# EAGLE design camera-tiny84-mark3 (EAGLE 7.4.0)
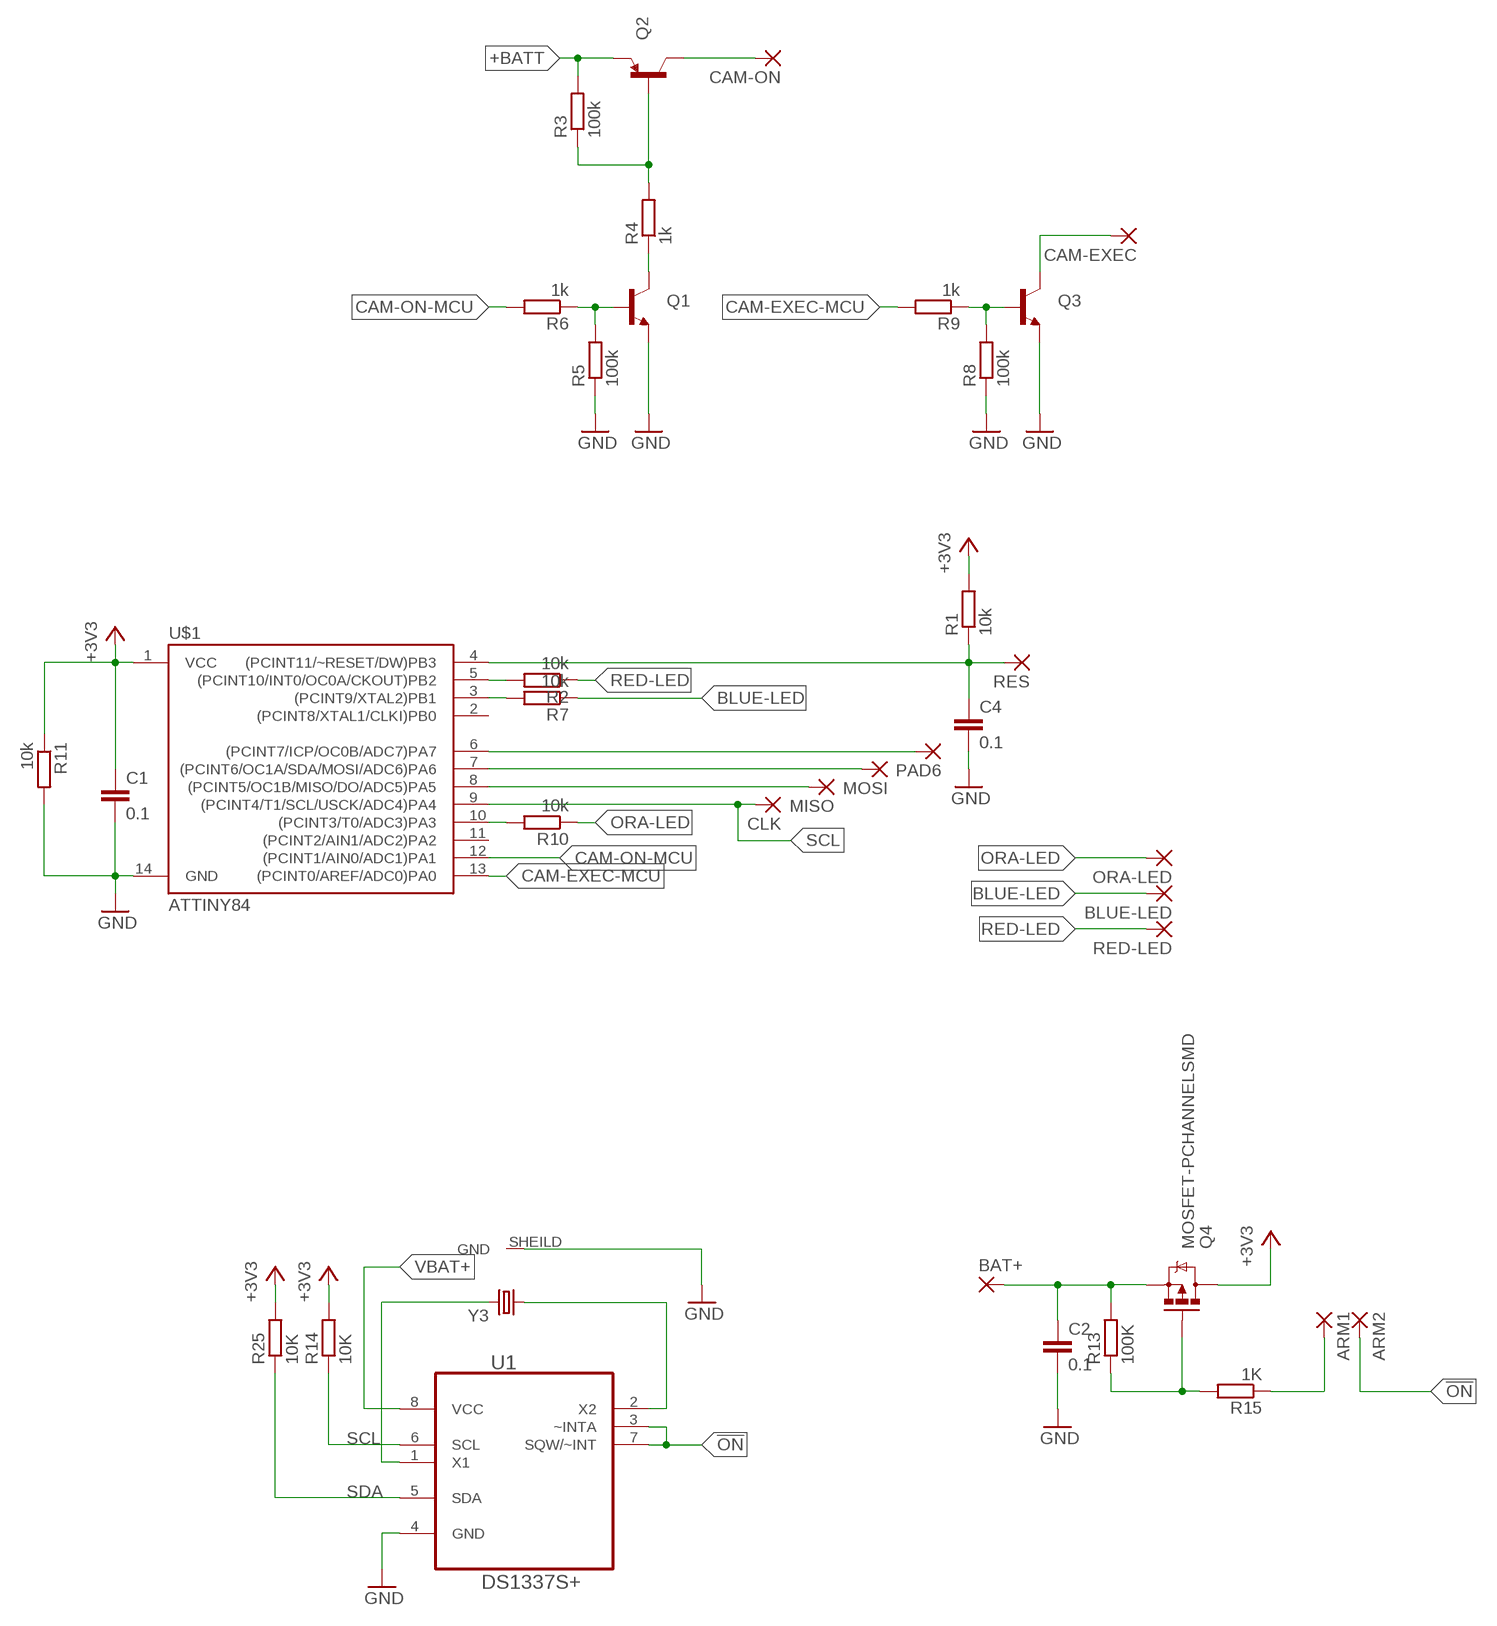
[diagram p0: schematic, sheet 1]

## Parts
ARM1  SMD2  [SMD1,27-2,54]
ARM2  SMD2  [SMD1,27-2,54]
BAT+  SMD2  [SMD1,27-2,54]
BLUE-LED  SMD2  [SMD1,27-2,54]
C1  0.1  C-EUC0603  [C0603]
C2  0.1  C-EUC0603  [C0603]
C4  0.1  C-EUC1206  [C1206]
CAM-EXEC  SMD2  [SMD1,27-2,54]
CAM-ON  SMD2  [SMD1,27-2,54]
CLK  1,6/0,8  [1,6/0,8]
MISO  1,6/0,8  [1,6/0,8]
MOSI  1,6/0,8  [1,6/0,8]
ORA-LED  SMD2  [SMD1,27-2,54]
PAD6  SMD2  [SMD1,27-2,54]
Q1  TRANSISTOR_NPNSOT23-3  [SOT23-3]
Q2  TRANSISTOR_PNPSMD  [SOT23-3]
Q3  TRANSISTOR_NPNSOT23-3  [SOT23-3]
Q4  MOSFET-PCHANNELSMD  [SOT23-3]
R1  10k  R-EU_R0603  [R0603]
R2  10k  R-EU_R0603  [R0603]
R3  100k  R-EU_R0603  [R0603]
R4  1k  R-EU_R0603  [R0603]
R5  100k  R-EU_R0603  [R0603]
R6  1k  R-EU_R0603  [R0603]
R7  10k  R-EU_R0603  [R0603]
R8  100k  R-EU_R0603  [R0603]
R9  1k  R-EU_R0603  [R0603]
R10  10k  R-EU_R0603  [R0603]
R11  10k  R-EU_R0603  [R0603]
R13  100K  R-EU_R0603  [R0603]
R14  10K  R-EU_R0603  [R0603]
R15  1K  R-EU_R0603  [R0603]
R25  10K  R-EU_R0603  [R0603]
RED-LED  SMD2  [SMD1,27-2,54]
RES  1,6/0,8  [1,6/0,8]
U1  DS1337S+  [SOIC127P600X175-8N]
U$1  ATTINY84  [SO14]
Y3  CRYSTAL32-SMD_CRYSTAL32-SMD  [CRYSTAL32-SMD_CRYSTAL-32KHZ-SMD]

## Nets
!ON: ARM2.1(P) U1.3(~INTA) U1.7(SQW/~INT)
+3V3: C1.1 Q4.3(D) R1.2 R11.1 R14.2 R25.2 U$1.1(VCC)
+BATT: Q2.2(E) R3.2
BLUE-LED: BLUE-LED.1(P) R7.1
CAM-EXEC-MCU: R9.2 U$1.13((PCINT0/AREF/ADC0)PA0)
CAM-ON-MCU: R6.2 U$1.12((PCINT1/AIN0/ADC1)PA1)
GND: C1.2 C2.2 C4.2 Q1.2(E) Q3.2(E) R5.1 R8.1 R11.2 U1.4(GND) U$1.14(GND) Y3.SHEILD(GND)
N$1: MISO.1(P) U$1.8((PCINT5/OC1B/MISO/DO/ADC5)PA5)
N$2: PAD6.1(P) U$1.6((PCINT7/ICP/OC0B/ADC7)PA7)
N$3: C4.1 R1.1 RES.1(P) U$1.4((PCINT11/~RESET/DW)PB3)
N$4: CAM-EXEC.1(P) Q3.3(C)
N$5: Q2.1(B) R3.1 R4.2
N$6: Q1.3(C) R4.1
N$7: Q1.1(B) R5.2 R6.1
N$8: Q3.1(B) R8.2 R9.1
N$9: CAM-ON.1(P) Q2.3(C)
N$10: Q4.1(G) R13.1 R15.2
N$11: ARM1.1(P) R15.1
N$12: R2.2 U$1.5((PCINT10/INT0/OC0A/CKOUT)PB2)
N$13: R7.2 U$1.3((PCINT9/XTAL2)PB1)
N$14: R10.2 U$1.10((PCINT3/T0/ADC3)PA3)
N$17: U1.2(X2) Y3.X1
N$18: U1.1(X1) Y3.X2
ORA-LED: ORA-LED.1(P) R10.1
RED-LED: R2.1 RED-LED.1(P)
SCL: CLK.1(P) R14.1 U1.6(SCL) U$1.9((PCINT4/T1/SCL/USCK/ADC4)PA4)
SDA: MOSI.1(P) R25.1 U1.5(SDA) U$1.7((PCINT6/OC1A/SDA/MOSI/ADC6)PA6)
VBAT+: BAT+.1(P) C2.1 Q4.2(S) R13.2 U1.8(VCC)
Unconnected: U$1.2((PCINT8/XTAL1/CLKI)PB0) U$1.11((PCINT2/AIN1/ADC2)PA2)

## Library data of the parts
ARM1 ARM2 BAT+ BLUE-LED CAM-EXEC CAM-ON ORA-LED PAD6 RED-LED = wirepad:SMD2: SMD PAD
C1 C2 C4 = rcl:C-EU: CAPACITOR, European symbol
CLK MISO MOSI RES = wirepad:1,6/0,8: THROUGH-HOLE PAD
Q1 Q3 = SparkFun-DiscreteSemi:TRANSISTOR_NPN: Generic NPN BJT MMBT2222A - TRANS-08049 (SOT-23, 1A 40V) MPSA42 - TRANS-09116 (SOT-23, 500mA 300V) MMBT5088LT1G - TRANS-11160 (SOT-23, 50 mA 30V) BC547 - COM-08928 <http://www.sparkfun.com/products/8928> (TO-92 45V 100mA) (1.Collector 2.Base 3.Emitter) 2N3904 - COM-00521 <http://www.sparkfun.com/products/521> (TO-92 40V 200mA) (1.Emitter 2.Base 3.Collector) P2N2222A - COM-12852 <http://www.sparkfun.com/products/12852> (TO-92 40V 600mA) (1.Collector 2.Base 3.Emitter); PROD_ID: TRANS-08049
Q2 = SparkFun-DiscreteSemi:TRANSISTOR_PNP: Generic PNP BJT Double check pinouts against datasheets- not all devices are the same! MMBT3906 - 40V 200mA SOT-23 (TRANS-08052) MMBT4403 - 40V 600mA SOT-23 (TRANS-09245)
Q4 = SparkFun-DiscreteSemi:MOSFET-PCHANNEL: Generic PMOSFET IRLML2244 - TRANS-11153 (SOT-23 -20V -4.3A) (1.Gate 2.Source 3.Drain) FQP27P06 - COM-10349 <http://www.sparkfun.com/products/10349> (TO-220 -60V -27A) (1.Gate 2.Source 3.Drain)
R1-R11 = rcl:R-EU_: RESISTOR, European symbol
R13-R15 R25 = resistor:R-EU_: RESISTOR, European symbol
U1 = Maxim_By_element14_Batch_1:DS1337S+: 64 x 8, Serial, I2C Real-Time Clock; MPN: DS1337S+; OC_FARNELL: 1379748; OC_NEWARK: 08J6237; PACKAGE: SOIC-8; SUPPLIER: Maxim
U$1 = SparkFun-DigitalIC:ATTINY84: Atmel 14-pin 2/4/8kB flash uC; PROD_ID: IC-11285
Y3 = purva_baterija:CRYSTAL32-SMD_CRYSTAL: Various standard crystals. Proven footprints.; PROD_ID: XTAL-07894

## Net classes
0 default: clearance 0.205 mm

## Board
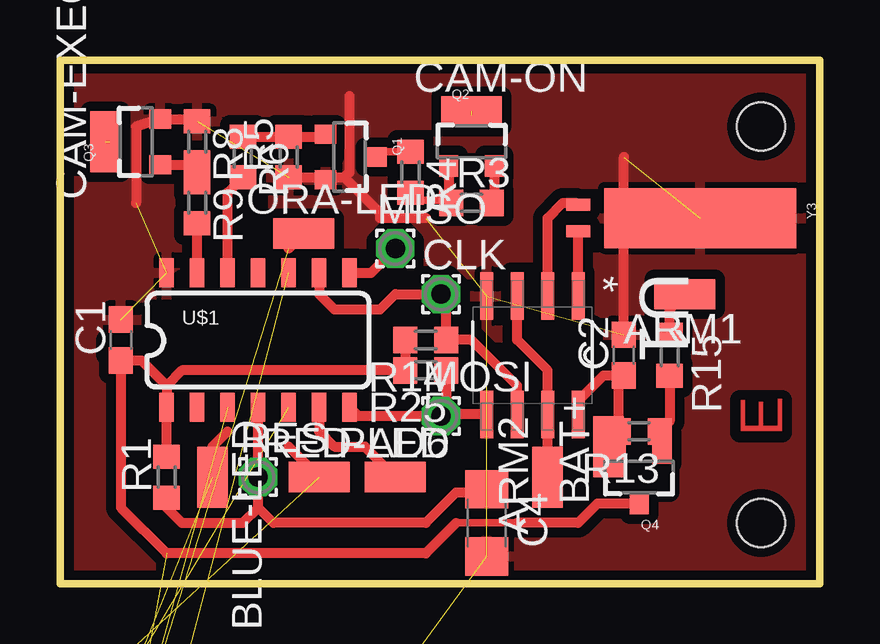
[diagram p1: board, top side]

Size 31.65 x 21.82 mm. Coordinates in mm from the lower left corner, seen from the top.
Outline: 31.65,0 31.65,21.82 0,21.82 0,0 31.65,0
Copper layers (1*16): Top 0.035mm / dielectric 1.5mm / Bottom 0.035mm
Design rules "default *": minimum track width 10mil, minimum drill 24mil, track to track 8mil, track to pad 8mil, pad to pad 8mil, via to via 8mil, smd to smd 8mil, copper to edge 10mil, drill to drill 8mil, minimum pad ring 10mil, minimum via ring 8mil, stop-mask expansion 4mil, vias tented up to drill 0mil, thermal gap 10mil
Holes 2 mm at 29.21,19.05 29.21,2.54
tRestrict: area 4.4,18.4 to 5.1,19.1; area 10.2,17.8 to 10.8,18.4; area 10.8,17.8 to 11.4,18.4; area 3.8,18.4 to 4.4,19.1; area 5.1,12.1 to 10.2,12.7; area 1.9,9.5 to 3.2,10.2; area 24.1,3.8 to 25.4,4.4; area 20.3,8.9 to 21.6,10.8; area 21.6,8.9 to 23.5,9.5; area 21.6,10.2 to 22.2,10.8; area 3.8,8.9 to 5.1,9.5; area 3.8,9.5 to 5.1,11.4; area 7.6,14.6 to 8.3,15.9; area 15.2,0.6 to 16.5,1.9

### Footprints (pad centres in the part's own frame; a part is rotated, then mirrored left to right if it is on the bottom)
SMD1,27-2,54 = smd 1.27 x 2.54: 1 0,0
C0603 = smd 1.1 x 1: 1 -0.85,0; 2 0.85,0
C1206 = smd 1.6 x 1.8: 1 -1.4,0; 2 1.4,0
1,6/0,8 = drill 0.813 pad 1.6 octagon: 1 0,0
SOT23-3 = smd 0.8 x 0.9: 1 -0.95,-1; 2 0.95,-1; 3 0,1.1
R0603 = smd 1 x 1.1: 1 -0.85,0; 2 0.85,0
SOIC127P600X175-8N = smd 1.981 x 0.533: 1 -2.464,1.905; 2 -2.464,0.635; 3 -2.464,-0.635; 4 -2.464,-1.905; 5 2.464,-1.905; 6 2.464,-0.635; 7 2.464,0.635; 8 2.464,1.905
SO14 = smd 0.6 x 1.2: 1 -3.81,-2.8; 2 -2.54,-2.8; 3 -1.27,-2.8; 4 0,-2.8; 5 1.27,-2.8; 6 2.54,-2.8; 7 3.81,-2.8; 8 3.81,2.8; 9 2.54,2.8; 10 1.27,2.8; 11 0,2.8; 12 -1.27,2.8; 13 -2.54,2.8; 14 -3.81,2.8
CRYSTAL32-SMD_CRYSTAL-32KHZ-SMD = smd 2.5 x 8: SHEILD 0,5.08 | smd 0.5 x 1: X1 -0.55,0; X2 0.55,0

### Placement (x,y rotation side)
ARM1  26.04,12.06 90 top
ARM2  20.32,4.45 0 top
BAT+  22.86,5.71 0 top
BLUE-LED  6.35,4.45 180 top
C1  2.54,10.16 90 top
C2  23.5,9.53 90 top
C4  17.78,2.54 270 top
CAM-EXEC  1.91,18.41 0 top
CAM-ON  17.14,19.68 270 top
CLK  15.88,12.06 0 top
MISO  13.97,13.97 0 top
MOSI  15.88,6.99 0 top
ORA-LED  10.16,14.61 270 top
PAD6  13.97,4.45 270 top
Q1  12.06,17.78 270 top
Q2  17.14,18.41 0 top
Q3  3.17,18.41 90 top
Q4  24.13,4.45 180 top
R1  4.45,4.45 90 top
R2  1.27,-5.08 0 top  (outside the outline)
R3  17.14,15.88 0 top
R4  14.61,17.14 270 top
R5  9.53,17.78 90 top
R6  7.62,17.78 270 top
R7  1.27,-10.16 0 top  (outside the outline)
R8  5.71,18.41 270 top
R9  5.71,15.88 270 top
R10  1.27,-15.24 0 top  (outside the outline)
R11  1.27,-20.32 0 top  (outside the outline)
R13  24.13,6.35 180 top
R14  15.24,10.16 180 top
R15  25.4,9.53 270 top
R25  15.24,8.89 180 top
RED-LED  10.79,4.45 270 top
RES  8.26,4.45 0 top
U1  19.68,9.53 270 top
U$1  8.26,10.16 0 top
Y3  21.59,15.24 270 top

### Tracks (layer width: path | path; a pad name or v marks a point on that pad's centre or on a via)
!ON
  Top 0.406: U1.3 19.05,10.16 20.32,8.89 U1.7 ARM2.1
+3V3  (1 unrouted)
  Top 0.305: 19.05,2.54 16.51,2.54
  Top 0.406: R14.2 R25.2 5.08,8.89 4.45,8.26 | 4.45,8.26 U$1.1 R1.2 | 4.45,8.26 3.39,9.31 C1.1 2.54,3.17 4.45,1.27 15.24,1.27 16.51,2.54 | Q4.3 22.39,3.35 21.59,2.54 19.05,2.54
+BATT
  Top 0.406: Q2.2 18.09,15.97 R3.2
BLUE-LED  (1 unrouted)
  Top 0.406: 6.99,6.35 6.35,5.71 BLUE-LED.1
CAM-EXEC-MCU
  Top 0.406: U$1.13 R9.2
CAM-ON-MCU
  Top 0.406: U$1.12 6.99,16.3 R6.2
GND  (8 unrouted)
  Top 0.406: Q1.2 10.96,16.93 R5.1 11.85,16.93 | R8.1 5.62,19.36 Q3.2 4.12,19.36 3.17,19.05 3.17,15.88 | C2.2 23.5,17.78 | 11.85,16.93 12.06,17.14 12.06,20.32 | 15.24,15.24 13.34,15.24 13.34,15.45 11.85,16.93
  pour Top (isolate 0.406): -0.64,22.23 32.38,22.23 32.38,-0.64 -0.64,-0.64
N$1
  Top 0.406: U$1.8 12.96,12.96 MISO.1
N$2
  Top 0.406: U$1.6 10.79,6.35 11.43,5.71 12.7,5.71 PAD6.1
N$3
  Top 0.406: U$1.4 RES.1 8.26,3.17 | R1.1 4.45,3.17 5.08,2.54 7.62,2.54 8.26,3.17 | 8.26,3.17 8.89,2.54 15.24,2.54 16.51,3.81 17.65,3.81 C4.1
N$4  (1 unrouted)
N$5
  Top 0.305: 16.2,15.97 14.93,15.97 R4.2
  Top 0.406: Q2.1 16.2,15.97 R3.1
N$6
  Top 0.305: R4.1 13.38,18 Q1.3
N$7
  Top 0.406: Q1.1 10.96,18.63 R5.2 R6.1
N$8
  Top 0.406: Q3.1 5.62,17.46 R8.2 R9.1
N$9  (1 unrouted)
N$10
  Top 0.406: Q4.1 24.98,5.54 R13.1 25.4,6.77 R15.2
N$11
  Top 0.406: R15.1 25.4,11.43 ARM1.1
N$12  (1 unrouted)
N$13  (1 unrouted)
N$14  (1 unrouted)
N$17
  Top 0.406: U1.2 20.32,15.24 20.95,15.88 21.5,15.88 Y3.X1
N$18
  Top 0.406: U1.1 Y3.X2
ORA-LED  (1 unrouted)
  Top 0.406: 9.53,13.97 ORA-LED.1
RED-LED  (1 unrouted)
  Top 0.406: 9.53,5.71 RED-LED.1
SCL
  Top 0.406: U$1.9 10.79,12.06 11.43,11.43 13.34,11.43 13.97,12.06 CLK.1 16.09,11.85 R14.1 17.14,10.16 19.05,8.26 U1.6
SDA
  Top 0.406: R25.1 16.09,7.2 MOSI.1 | MOSI.1 12.44,6.99 U$1.7 | U1.5 15.95,7.06 MOSI.1
VBAT+
  Top 0.406: U1.8 21.59,7.62 22.64,8.68 C2.1 23.28,8.46 R13.2 23.28,6.13 BAT+.1 22.91,5.71 Q4.2

### Text on the board
Top: E